# Altium schematic sheet UART.SchDoc
size A3; Author: Marcelo Vicente; Organization: Univ. of Wisconsin-Madison; Address1: Madison, WI 53706; DocumentNumber: 5; SheetNumber: 5; SheetTotal: 5
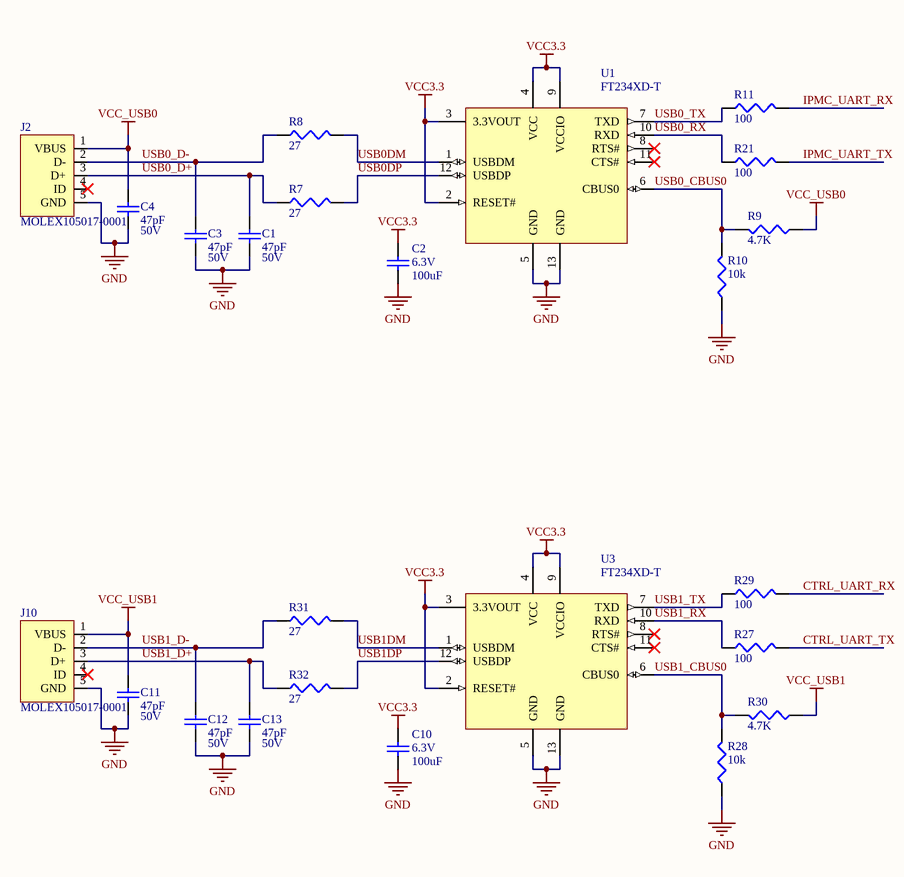
[diagram p0: UART.SchDoc]

## Parts
C1  value 47pF  Rating: 50V  [C0402]  (hidden comment: ?)
C2  value 100uF  Rating: 6.3V  [C1210_IPC_H]  (hidden comment: ?)
C3  value 47pF  Rating: 50V  [C0402]  (hidden comment: ?)
C4  value 47pF  Rating: 50V  [C0402]  (hidden comment: ?)
C10  value 100uF  Rating: 6.3V  [C1210_IPC_H]  (hidden comment: ?)
C11  value 47pF  Rating: 50V  [C0402]  (hidden comment: ?)
C12  value 47pF  Rating: 50V  [C0402]  (hidden comment: ?)
C13  value 47pF  Rating: 50V  [C0402]  (hidden comment: ?)
J2  MOLEX105017-0001  [MOLEX105017-0001]
J10  MOLEX105017-0001  [MOLEX105017-0001]
R7  value 27  [R0603]  (hidden comment: ?)
R8  value 27  [R0603]  (hidden comment: ?)
R9  value 4.7K  [R0402_IPC_H]  (hidden comment: ?)
R10  value 10k  [R0402_IPC_H]  (hidden comment: ?)
R11  value 100  [R0603]  (hidden comment: ?)
R21  value 100  [R0603]  (hidden comment: ?)
R27  value 100  [R0603]  (hidden comment: ?)
R28  value 10k  [R0402_IPC_H]  (hidden comment: ?)
R29  value 100  [R0603]  (hidden comment: ?)
R30  value 4.7K  [R0402_IPC_H]  (hidden comment: ?)
R31  value 27  [R0603]  (hidden comment: ?)
R32  value 27  [R0603]  (hidden comment: ?)
U1  FT234XD-T  [DFN-12_V]
U3  FT234XD-T  [DFN-12_V]

## Nets
GND: C1.1 C2.1 C3.1 C4.1 C10.1 C11.1 C12.1 C13.1 J2.5(GND) J10.5(GND) R10.1 R28.1 U1.5(GND) U1.13(GND) U3.5(GND) U3.13(GND)
VCC3.3: C2.2 C10.2 U1.2(RESET#) U1.3(3.3VOUT) U1.4(VCC) U1.9(VCCIO) U3.2(RESET#) U3.3(3.3VOUT) U3.4(VCC) U3.9(VCCIO)
VCC_USB0: C4.2 J2.1(VBUS) R9.1
VCC_USB1: C11.2 J10.1(VBUS) R30.1
CTRL_UART_RX: R29.2
CTRL_UART_TX: R27.2
IPMC_UART_RX: R11.2
IPMC_UART_TX: R21.2
USB0_CBUS0: R9.2 R10.2 U1.6(CBUS0)
USB0_D+: C1.2 J2.3(D+) R7.1
USB0_D-: C3.2 J2.2(D-) R8.1
USB0_RX: R21.1 U1.10(RXD)
USB0_TX: R11.1 U1.7(TXD)
USB0DM: R8.2 U1.1(USBDM)
USB0DP: R7.2 U1.12(USBDP)
USB1_CBUS0: R28.2 R30.2 U3.6(CBUS0)
USB1_D+: C13.2 J10.3(D+) R32.1
USB1_D-: C12.2 J10.2(D-) R31.1
USB1_RX: R27.1 U3.10(RXD)
USB1_TX: R29.1 U3.7(TXD)
USB1DM: R31.2 U3.1(USBDM)
USB1DP: R32.2 U3.12(USBDP)

Not connected (* = marked no-connect by the designer): J2 4(ID)*; J10 4(ID)*; U1 8(RTS#)* 11(CTS#)*; U3 8(RTS#)* 11(CTS#)*

## Notes on the sheet
- Description
- Title
- Size:
- Date:
- A3
- Number:
- Time:
- Revision:
- Sheet
- of
- File:
- Author:

## Library data of the parts
C1 C3 C4 C11-C13 = Cap Semi: Capacitor (Semiconductor SIM Model); Mfg. Part No.: CC0402JRNPO9BN470; INVKEY: CP0402-47PF-50V-5%; Mfgr: Yageo
C2 C10 = Cap: Capacitor; Mfg. Part No.: GRM32ER60J107ME20L; INVKEY: CP1210-100UF-6.3V-20%; Mfgr: Murata
J2 J10 = MOLEX105017-0001: Micro USB Bottom Mount Receptable, B Type; INVKEY: CO-USB-MICRO-SOLDERTAIL; Mfgr: Molex; Mfg. Part No.: 105017-0001
R7 R8 R31 R32 = Res3: Resistor; INVKEY: ?; Mfg. Part No.: ?; Mfgr: ?
R9 R30 = Res: Resistor; Mfg. Part No.: ERJ-2GEJ472X; Tolerance: 5%; INVKEY: RS0402-4K7-1/10W-5%; Mfgr: Panasonic-ECG
R10 R28 = Res: Resistor; Mfg. Part No.: ERJ-2GEJ103X; Tolerance: 5%; INVKEY: RS0402-10K-1/10W-5%; Mfgr: Panasonic-ECG
R11 R21 R27 R29 = Res3: Resistor; Mfg. Part No.: RC0603FR-07100RL; INVKEY: RS0603-100R-1/10W-1%; Mfgr: Yageo
U1 U3 = CMP-0248-00028-1: FT234XD USB to BASIC UART IC, -40 to +85 degC, 12-Pin DFN, Pb-Free, Tray; INVKEY: ?; Mfg. Part No.: ?; Mfgr: ?